# Altium schematic sheet RCJ_OnStage2024_FC_drivers.SchDoc
size 891 x 420 mm; SheetNumber: 2; SheetTotal: 4; SheetSize: А3
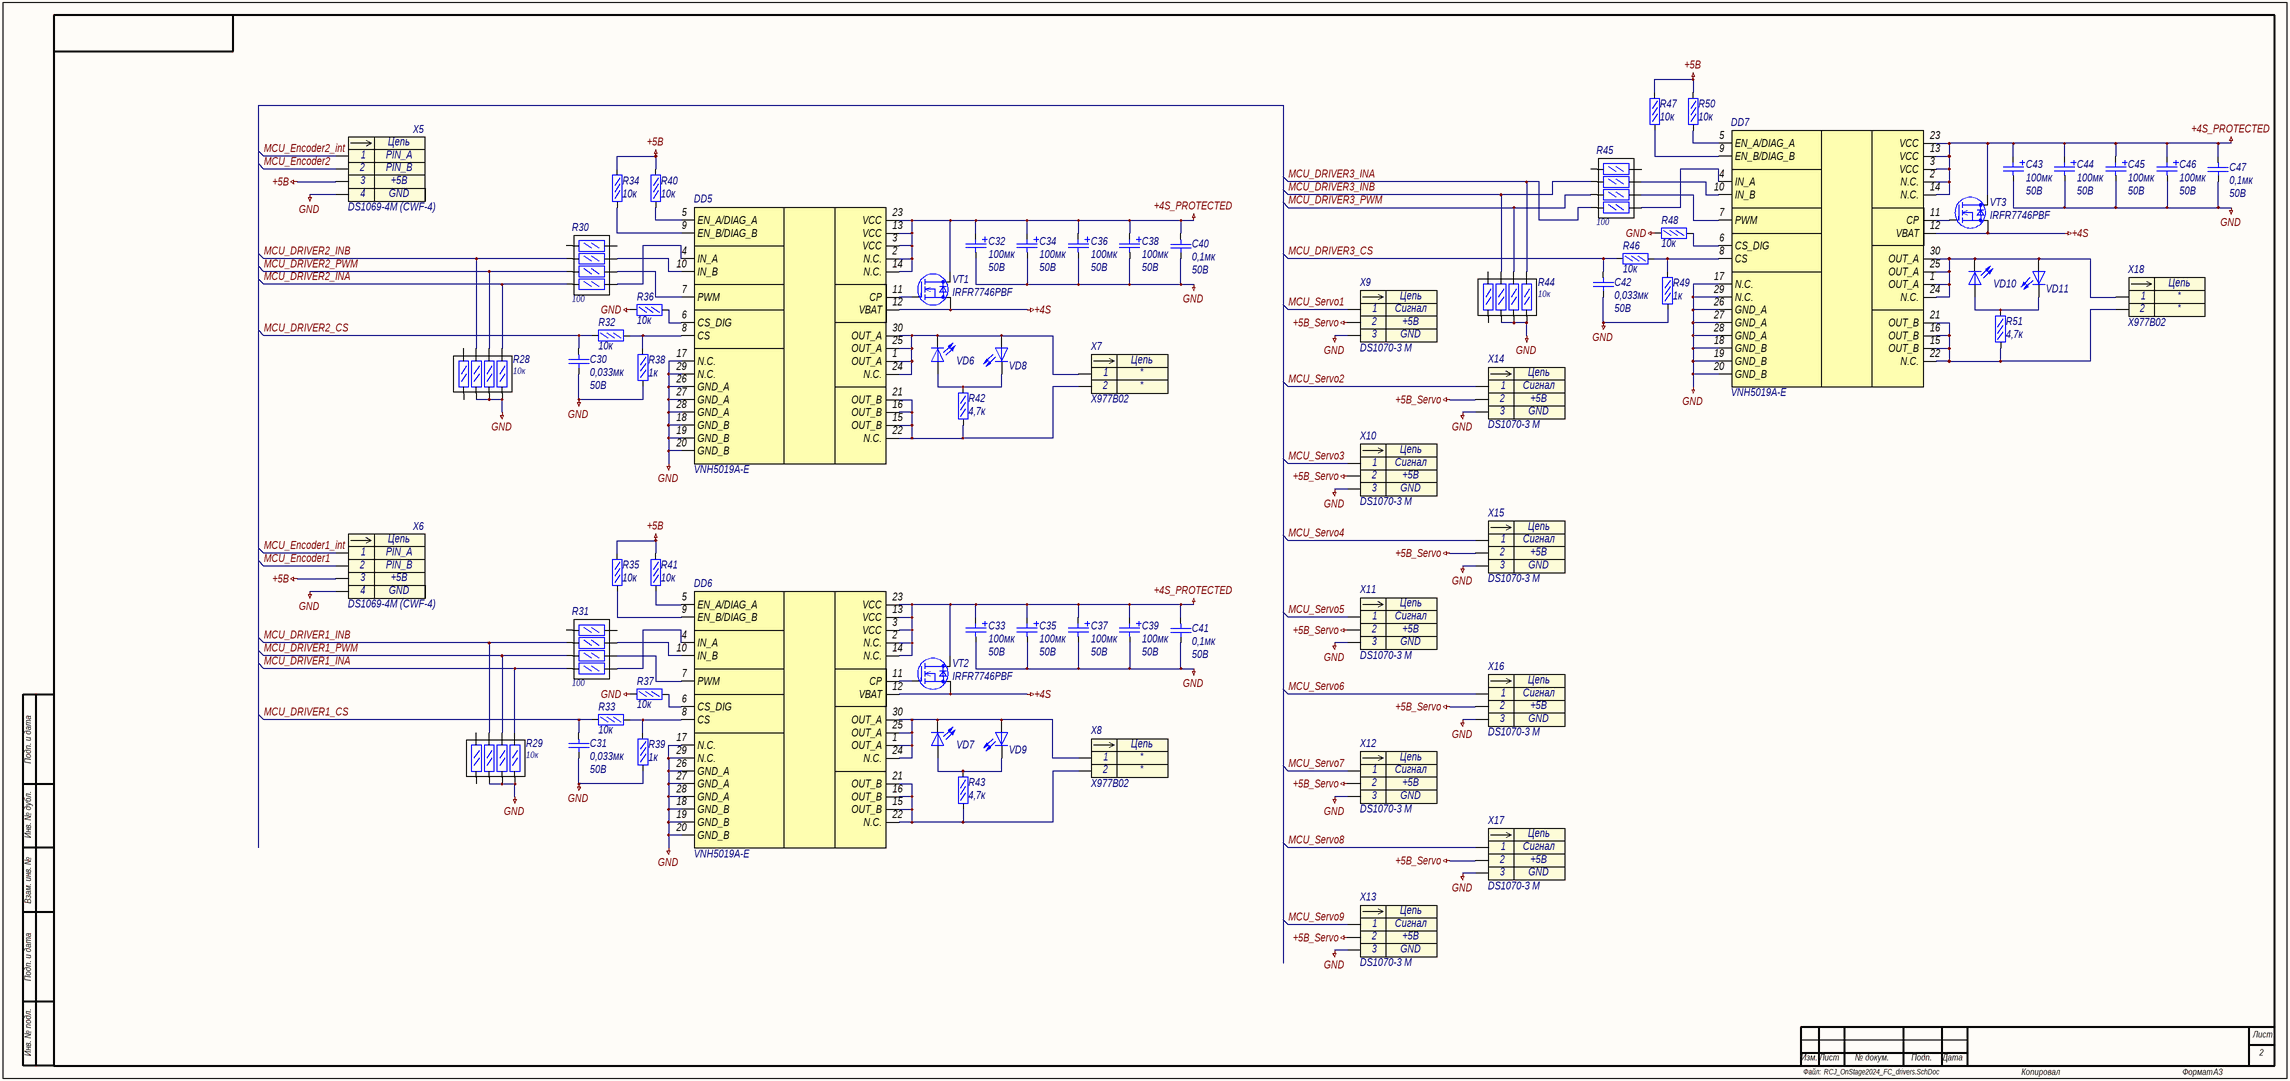
[diagram p0: RCJ_OnStage2024_FC_drivers.SchDoc]

## Parts
C30  0,033мк  Voltage: 50В  [C1206]
C31  0,033мк  Voltage: 50В  [C1206]
C32  100мк  Voltage: 50В  [CAPALUM_8x11.5_V]
C33  100мк  Voltage: 50В  [CAPALUM_8x11.5_V]
C34  100мк  Voltage: 50В  [CAPALUM_8x11.5_V]
C35  100мк  Voltage: 50В  [CAPALUM_8x11.5_V]
C36  100мк  Voltage: 50В  [CAPALUM_8x11.5_V]
C37  100мк  Voltage: 50В  [CAPALUM_8x11.5_V]
C38  100мк  Voltage: 50В  [CAPALUM_8x11.5_V]
C39  100мк  Voltage: 50В  [CAPALUM_8x11.5_V]
C40  0,1мк  Voltage: 50В  [C0603]
C41  0,1мк  Voltage: 50В  [C0603]
C42  0,033мк  Voltage: 50В  [C1206]
C43  100мк  Voltage: 50В  [CAPALUM_8x11.5_V]
C44  100мк  Voltage: 50В  [CAPALUM_8x11.5_V]
C45  100мк  Voltage: 50В  [CAPALUM_8x11.5_V]
C46  100мк  Voltage: 50В  [CAPALUM_8x11.5_V]
C47  0,1мк  Voltage: 50В  [C0603]
DD5  VNH5019A-E  [SO-30]
DD6  VNH5019A-E  [SO-30]
DD7  VNH5019A-E  [SO-30]
R28  10к  [R0603x4]
R29  10к  [R0603x4]
R30  100  [R0603x4]
R31  100  [R0603x4]
R32  10к  [R0603]
R33  10к  [R0603]
R34  10к  [R0603]
R35  10к  [R0603]
R36  10к  [R0603]
R37  10к  [R0603]
R38  1к  [R0603]
R39  1к  [R0603]
R40  10к  [R0603]
R41  10к  [R0603]
R42  4,7к  [R0603]
R43  4,7к  [R0603]
R44  10к  [R0603x4]
R45  100  [R0603x4]
R46  10к  [R0603]
R47  10к  [R0603]
R48  10к  [R0603]
R49  1к  [R0603]
R50  10к  [R0603]
R51  4,7к  [R0603]
VD6  (no value)  [LED0603_RED]
VD7  (no value)  [LED0603_RED]
VD8  (no value)  [LED0603_GREEN]
VD9  (no value)  [LED0603_GREEN]
VD10  (no value)  [LED0603_RED]
VD11  (no value)  [LED0603_GREEN]
VT1  IRFR7746PBF  [D-PAK]
VT2  IRFR7746PBF  [D-PAK]
VT3  IRFR7746PBF  [D-PAK]
X5  DS1069-4M (CWF-4)  [CWF-4]
X6  DS1069-4M (CWF-4)  [CWF-4]
X7  X977B02  [DG25C-B-02P]
X8  X977B02  [DG25C-B-02P]
X9  DS1070-3 M  [DS1070-3]
X10  DS1070-3 M  [DS1070-3]
X11  DS1070-3 M  [DS1070-3]
X12  DS1070-3 M  [DS1070-3]
X13  DS1070-3 M  [DS1070-3]
X14  DS1070-3 M  [DS1070-3]
X15  DS1070-3 M  [DS1070-3]
X16  DS1070-3 M  [DS1070-3]
X17  DS1070-3 M  [DS1070-3]
X18  X977B02  [DG25C-B-02P]

## Nets
+4S: DD5.12(VBAT) DD6.12(VBAT) DD7.12(VBAT) VT1.3(S) VT2.3(S) VT3.3(S)
+4S_PROTECTED: C32.1 C33.1 C34.1 C35.1 C36.1 C37.1 C38.1 C39.1 C40.2 C41.2 C43.1 C44.1 C45.1 C46.1 C47.2 DD5.2(N.C.) DD5.3(VCC) DD5.13(VCC) DD5.14(N.C.) DD5.23(VCC) DD6.2(N.C.) DD6.3(VCC) DD6.13(VCC) DD6.14(N.C.) DD6.23(VCC) DD7.2(N.C.) DD7.3(VCC) DD7.13(VCC) DD7.14(N.C.) DD7.23(VCC) VT1.2(D) VT2.2(D) VT3.2(D)
+5В: R34.2 R35.2 R40.2 R41.2 R47.2 R50.2 X5.3 X6.3
+5В_Servo: X9.2 X10.2 X11.2 X12.2 X13.2 X14.2 X15.2 X16.2 X17.2
GND: C30.1 C31.1 C32.2 C33.2 C34.2 C35.2 C36.2 C37.2 C38.2 C39.2 C40.1 C41.1 C42.1 C43.2 C44.2 C45.2 C46.2 C47.1 DD5.17(N.C.) DD5.18(GND_B) DD5.19(GND_B) DD5.20(GND_B) DD5.26(GND_A) DD5.27(GND_A) DD5.28(GND_A) DD5.29(N.C.) DD6.17(N.C.) DD6.18(GND_B) DD6.19(GND_B) DD6.20(GND_B) DD6.26(GND_A) DD6.27(GND_A) DD6.28(GND_A) DD6.29(N.C.) DD7.17(N.C.) DD7.18(GND_B) DD7.19(GND_B) DD7.20(GND_B) DD7.26(GND_A) DD7.27(GND_A) DD7.28(GND_A) DD7.29(N.C.) R28.3 R28.5 R28.7 R29.3 R29.5 R29.7 R36.1 R37.1 R38.1 R39.1 R44.3 R44.5 R44.7 R48.1 R49.1 X5.4 X6.4 X9.3 X10.3 X11.3 X12.3 X13.3 X14.3 X15.3 X16.3 X17.3
MCU_DRIVER1_CS: C31.2 R33.1
MCU_DRIVER1_INA: R29.8 R31.7
MCU_DRIVER1_INB: R29.4 R31.3
MCU_DRIVER1_PWM: R29.6 R31.5
MCU_DRIVER2_CS: C30.2 R32.1
MCU_DRIVER2_INA: R28.8 R30.7
MCU_DRIVER2_INB: R28.4 R30.3
MCU_DRIVER2_PWM: R28.6 R30.5
MCU_DRIVER3_CS: C42.2 R46.1
MCU_DRIVER3_INA: R44.8 R45.7
MCU_DRIVER3_INB: R44.4 R45.3
MCU_DRIVER3_PWM: R44.6 R45.5
MCU_Encoder1: X6.2
MCU_Encoder1_int: X6.1
MCU_Encoder2: X5.2
MCU_Encoder2_int: X5.1
MCU_Servo1: X9.1
MCU_Servo2: X14.1
MCU_Servo3: X10.1
MCU_Servo4: X15.1
MCU_Servo5: X11.1
MCU_Servo6: X16.1
MCU_Servo7: X12.1
MCU_Servo8: X17.1
MCU_Servo9: X13.1
NetDD5_1: DD5.1(OUT_A) DD5.24(N.C.) DD5.25(OUT_A) DD5.30(OUT_A) VD6.1(K) VD8.2(A) X7.1
NetDD5_4: DD5.4(IN_A) R30.8
NetDD5_5: DD5.5(EN_A/DIAG_A) R40.1
NetDD5_6: DD5.6(CS_DIG) R36.2
NetDD5_7: DD5.7(PWM) R30.6
NetDD5_8: DD5.8(CS) R32.2 R38.2
NetDD5_9: DD5.9(EN_B/DIAG_B) R34.1
NetDD5_10: DD5.10(IN_B) R30.4
NetDD5_11: DD5.11(CP) VT1.1(G)
NetDD5_15: DD5.15(OUT_B) DD5.16(OUT_B) DD5.21(OUT_B) DD5.22(N.C.) R42.2 X7.2
NetDD6_1: DD6.1(OUT_A) DD6.24(N.C.) DD6.25(OUT_A) DD6.30(OUT_A) VD7.1(K) VD9.2(A) X8.1
NetDD6_4: DD6.4(IN_A) R31.8
NetDD6_5: DD6.5(EN_A/DIAG_A) R41.1
NetDD6_6: DD6.6(CS_DIG) R37.2
NetDD6_7: DD6.7(PWM) R31.6
NetDD6_8: DD6.8(CS) R33.2 R39.2
NetDD6_9: DD6.9(EN_B/DIAG_B) R35.1
NetDD6_10: DD6.10(IN_B) R31.4
NetDD6_11: DD6.11(CP) VT2.1(G)
NetDD6_15: DD6.15(OUT_B) DD6.16(OUT_B) DD6.21(OUT_B) DD6.22(N.C.) R43.2 X8.2
NetDD7_1: DD7.1(OUT_A) DD7.24(N.C.) DD7.25(OUT_A) DD7.30(OUT_A) VD10.1(K) VD11.2(A) X18.1
NetDD7_4: DD7.4(IN_A) R45.8
NetDD7_5: DD7.5(EN_A/DIAG_A) R50.1
NetDD7_6: DD7.6(CS_DIG) R48.2
NetDD7_7: DD7.7(PWM) R45.6
NetDD7_8: DD7.8(CS) R46.2 R49.2
NetDD7_9: DD7.9(EN_B/DIAG_B) R47.1
NetDD7_10: DD7.10(IN_B) R45.4
NetDD7_11: DD7.11(CP) VT3.1(G)
NetDD7_15: DD7.15(OUT_B) DD7.16(OUT_B) DD7.21(OUT_B) DD7.22(N.C.) R51.2 X18.2
NetR42_1: R42.1 VD6.2(A) VD8.1(K)
NetR43_1: R43.1 VD7.2(A) VD9.1(K)
NetR51_1: R51.1 VD10.2(A) VD11.1(K)

Not connected (* = marked no-connect by the designer): R28 1 2; R29 1 2; R30 1 2; R31 1 2; R44 1 2; R45 1 2

## Notes on the sheet
- Подп. и дата
- Инв. № дубл.
- Взам. инв. №
- Инв. № подл.
- Лист
- Файл:
- Изм.
- № докум.
- Подп.
- Дата
- Копировал
- Формат
- (in symbol CWF-4) Цепь
- (in symbol WF-3) Цепь
- (in symbol X977B02) Цепь

## Library data of the parts
C30 C31 C42 = GRM3195C1H333J: Конденсатор кер. 0,033мкФ 50В NP0; Manufacturer: Murata; Name: GRM3195C1H333J; TKE: NP0; Value: 0,033мк
C32-C39 C43-C46 = B41858C6107M: Конденсатор эл.лит. алюм. 100мкФ 50В; Manufacturer: EPCOS; ESR: 0,6Ом; Name: B41858C6107; Value: 100мк
C40 C41 C47 = GRM188R71H104KA93D: Конденсатор кер. 0,1мкФ 50В X7R; Manufacturer: Murata; Name: GRM188R71H104KA93D; TKE: X7R; Value: 0,1мк
R28 R29 R44 = Резисторная сборка х4 0,125 10кОм: Резисторы  0,125Вт; Value: 10к
R30 R31 R45 = Резисторная сборка х4 0,125: Резисторы  0,125Вт; Value: 100
R32-R37 R40 R41 R46-R48 R50 = RC0603FR-0710KL: Резистор 10кОм 0,063Вт 1%; Manufacturer: YAGEO; Name: RC0603FR-0710KL; Tolerance: 1%; Value: 10к
R38 R39 R49 = RC0603FR-071KL: Резистор 1кОм 0,063Вт 1%; Manufacturer: YAGEO; Name: RC0603FR-071KL; Tolerance: 1%; Value: 1к
R42 R43 R51 = RC0603FR-074K7L: Резистор 4,7кОм 0,063Вт 1%; Manufacturer: YAGEO; Name: RC0603FR-074K7L; Tolerance: 1%; Value: 4,7к
VD6-VD11 = LED: Светодиод
VT1-VT3 = IRFR7746PBF: N-MOSFET 75В, 56А; Manufacturer: Internationa Rectifier; Name: IRFR7746PBF
X5 X6 = CWF-4: Разъем - 4 конт. прямая вилка на плату; Contact_1: PIN_A; Contact_2: PIN_B; Contact_3: +5В; Contact_4: GND; Name: DS1069-4M (CWF-4)
X7 X8 X18 = X977B02: Клеммник 2-контактный шаг 7.62мм; Name: X977B02; Contact_1: *; Contact_2: *
X9-X17 = WF-3: Вилка на плату 2.54мм открытая 3pin; Contact_1: Сигнал; Contact_2: +5В; Contact_3: GND; Name: DS1070-3 M
DD5-DD7 = VNH5019A-E: Name: VNH5019A-E